# EAGLE schematic DETECTOR01 (EAGLE 6.1)
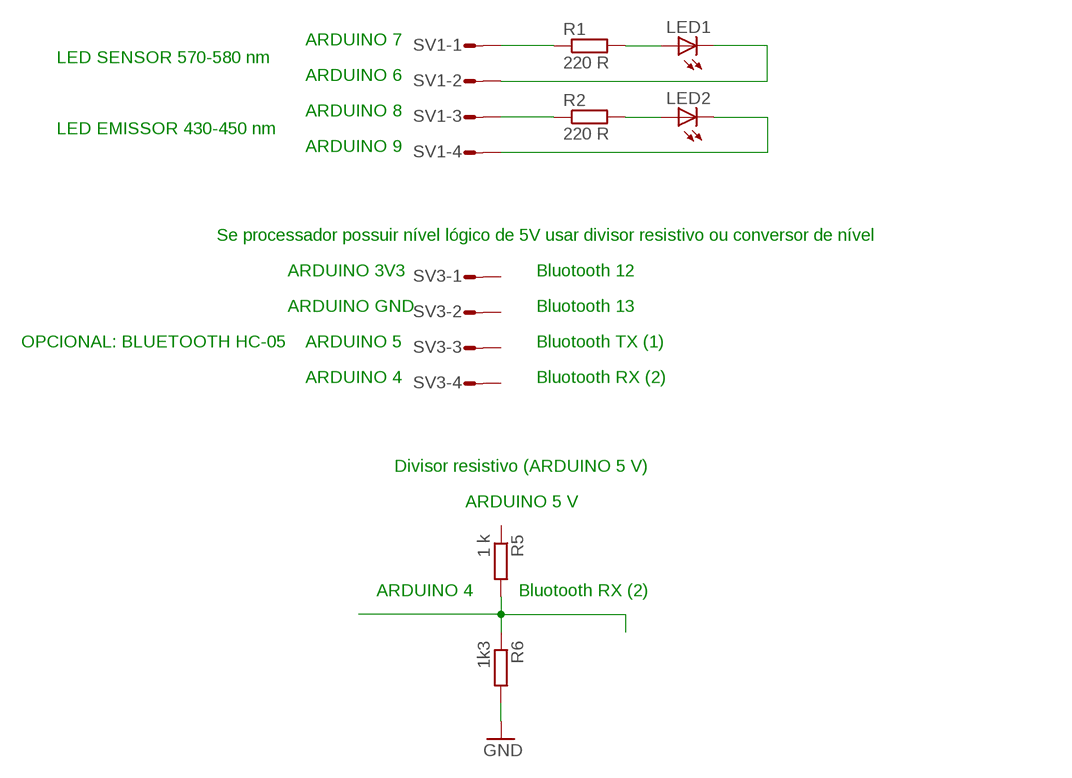
[diagram p0: schematic, sheet 1]

## Parts
LED1  LED5MM  [LED5MM]
LED2  LED5MM  [LED5MM]
R1  220 R  R-EU_0204/7  [0204/7]
R2  220 R  R-EU_0204/7  [0204/7]
R5  1 k  R-EU_0204/7  [0204/7]
R6  1k3  R-EU_0204/7  [0204/7]
SV1  L04P  [L04P]
SV3  L04P  [L04P]

## Nets
GND: R6.2
N$1: R1.1 SV1.1
N$2: LED1.A R1.2
N$3: LED1.K(C) SV1.2
N$4: R2.1 SV1.3
N$5: LED2.A R2.2
N$6: LED2.K(C) SV1.4
N$7: R5.2 R6.1
Unconnected: R5.1 SV3.1 SV3.2 SV3.3 SV3.4

## Notes on the sheet
- ARDUINO 7
- LED SENSOR 570-580 nm
- ARDUINO 6
- ARDUINO 8
- LED EMISSOR 430-450 nm
- ARDUINO 9
- Se processador possuir nível lógico de 5V usar divisor resistivo ou conversor de nível
- ARDUINO 3V3 | Bluotooth 12
- ARDUINO GND | Bluotooth 13
- OPCIONAL: BLUETOOTH HC-05 | ARDUINO 5 | Bluotooth TX (1)
- ARDUINO 4 | Bluotooth RX (2)
- Divisor resistivo (ARDUINO 5 V)
- ARDUINO 5 V
- ARDUINO 4 | Bluotooth RX (2)

## Library data of the parts
LED1 LED2 = led:LED: LED OSRAM: - CHIPLED LG R971, LG N971, LY N971, LG Q971, LY Q971, LO R971, LY R971 LH N974, LH R974 LS Q976, LO Q976, LY Q976 LO Q996 - Hyper CHIPLED LW Q18S LB Q993, LB Q99A, LB R99A - SideLED LS A670, LO A670, LY A670, LG A670, LP A670 LB A673, LV A673, LT A673, LW A673 LH A674 LY A675 LS A676, LA A676, LO A676, LY A676, LW A676 LS A679, LY A679, LG A679 - Hyper Micro SIDELED® LS Y876, LA Y876, LO Y876, LY Y876 LT Y87S - SmartLED LW L88C, LW L88S LB L89C, LB L89S, LG L890 LS L89K, LO L89K, LY L89K LS L896, LA L896, LO L896, LY L896 - TOPLED LS T670, LO T670, LY T670, LG T670, LP T670 LSG T670, LSP T670, LSY T670, LOP T670, LYG T670 LG T671, LOG T671, LSG T671 LB T673, LV T673, LT T673, LW T673 LH T674 LS T676, LA T676, LO T676, LY T676, LB T676, LH T676, LSB T676, LW T676 LB T67C, LV T67C, LT T67C, LS T67K, LO T67K, LY T67K, LW E67C LS E67B, LA E67B, LO E67B, LY E67B, LB E67C, LV E67C, LT E67C LW T67C LS T679, LY T679, LG T679 LS T770, LO T770, LY T770, LG T770, LP T770 LB T773, LV T773, LT T773, LW T773 LH T774 LS E675, LA E675, LY E675, LS T675 LS T776, LA T776, LO T776, LY T776, LB T776 LHGB T686 LT T68C, LB T68C - Hyper Mini TOPLED® LB M676 - Mini TOPLED Santana® LG M470 LS M47K, LO M47K, LY M47K Source: http://www.osram.convergy.de LUXEON: - LUMILED® LXK2-PW12-R00, LXK2-PW12-S00, LXK2-PW14-U00, LXK2-PW14-V00 LXK2-PM12-R00, LXK2-PM12-S00, LXK2-PM14-U00 LXK2-PE12-Q00, LXK2-PE12-R00, LXK2-PE12-S00, LXK2-PE14-T00, LXK2-PE14-U00 LXK2-PB12-K00, LXK2-PB12-L00, LXK2-PB12-M00, LXK2-PB14-N00, LXK2-PB14-P00, LXK2-PB14-Q00 LXK2-PR12-L00, LXK2-PR12-M00, LXK2-PR14-Q00, LXK2-PR14-R00 LXK2-PD12-Q00, LXK2-PD12-R00, LXK2-PD12-S00 LXK2-PH12-R00, LXK2-PH12-S00 LXK2-PL12-P00, LXK2-PL12-Q00, LXK2-PL12-R00 Source: www.luxeon.com KINGBRIGHT: KA-3528ASYC Source: www.kingbright.com
R1 R2 R5 R6 = rcl:R-EU_: RESISTOR, European symbol
SV1 SV3 = con-amp-mt:L04P: AMP MT CONNECTOR; OC_FARNELL: unknown; OC_NEWARK: unknown